# Altium schematic sheet Sheet2.SchDoc
size A4; SheetNumber: 3; SheetTotal: 3
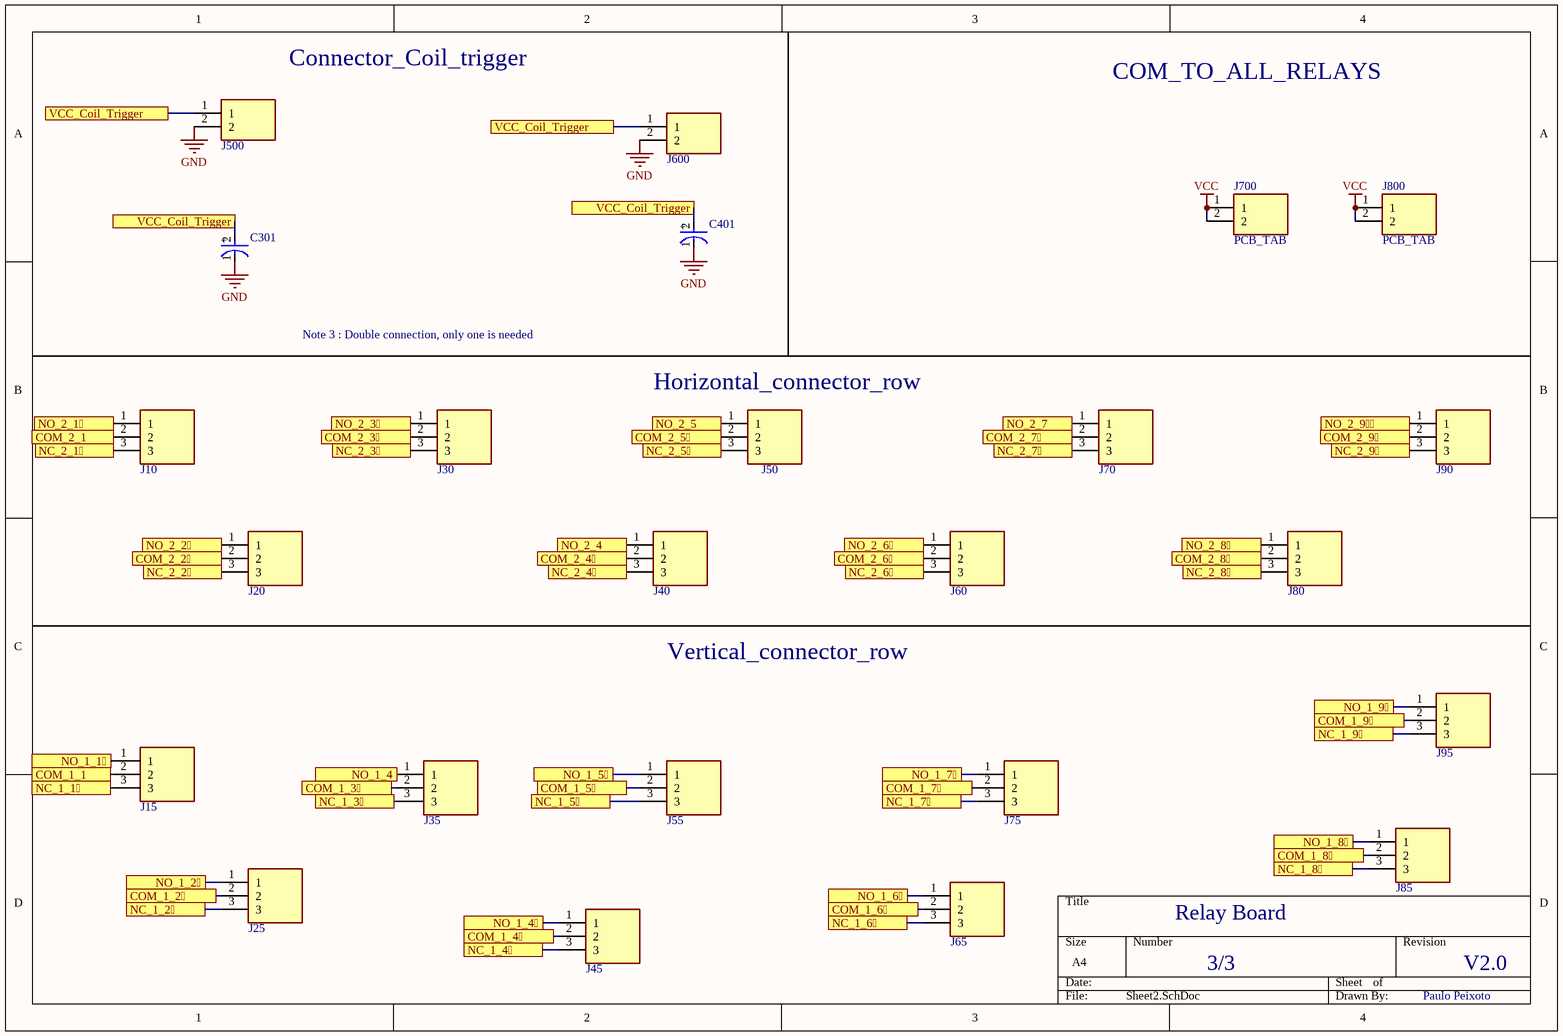
[diagram p0: Sheet2.SchDoc]

## Parts
C301  EEE-FK1H100UR  [FP-FKC-MFG]  (value not drawn)
C401  EEE-FK1H100UR  [FP-FKC-MFG]  (value not drawn)
J10  1546551-3  [Terminal_3p_3.5mm_Horizontal]  (value not drawn)
J15  1546551-3  [Terminal_THT_3p_3.5mm_Vertical]  (value not drawn)
J20  1546551-3  [Terminal_3p_3.5mm_Horizontal]  (value not drawn)
J25  1546551-3  [Terminal_THT_3p_3.5mm_Vertical]  (value not drawn)
J30  1546551-3  [Terminal_3p_3.5mm_Horizontal]  (value not drawn)
J35  1546551-3  [Terminal_THT_3p_3.5mm_Vertical]  (value not drawn)
J40  1546551-3  [Terminal_3p_3.5mm_Horizontal]  (value not drawn)
J45  1546551-3  [Terminal_THT_3p_3.5mm_Vertical]  (value not drawn)
J50  1546551-3  [Terminal_3p_3.5mm_Horizontal]  (value not drawn)
J55  1546551-3  [Terminal_THT_3p_3.5mm_Vertical]  (value not drawn)
J60  1546551-3  [Terminal_3p_3.5mm_Horizontal]  (value not drawn)
J65  1546551-3  [Terminal_THT_3p_3.5mm_Vertical]  (value not drawn)
J70  1546551-3  [Terminal_3p_3.5mm_Horizontal]  (value not drawn)
J75  1546551-3  [Terminal_THT_3p_3.5mm_Vertical]  (value not drawn)
J80  1546551-3  [Terminal_3p_3.5mm_Horizontal]  (value not drawn)
J85  1546551-3  [Terminal_THT_3p_3.5mm_Vertical]  (value not drawn)
J90  1546551-3  [Terminal_3p_3.5mm_Horizontal]  (value not drawn)
J95  1546551-3  [Terminal_THT_3p_3.5mm_Vertical]  (value not drawn)
J500  TB004-508-02BE  [Terminal_TH_2P_3.50]  (value not drawn)
J600  TB004-508-02BE  [Terminal_TH_2P_3.50]  (value not drawn)
J700  PCB_TAB  [PCB_TAB_Vertical_6.35mm]
J800  PCB_TAB  [PCB_TAB_Vertical_6.35mm]

## Ports
COM_1_1 (see Sheet1[2B]), COM_1_2 (see Sheet1[4B]), COM_1_3 (see Sheet1[6B]), COM_1_4 (see Sheet1[2C]), COM_1_5 (see Sheet1[4C]), COM_1_6 (see Sheet1[6C]), COM_1_7 (see Sheet1[2D]), COM_1_8 (see Sheet1[4D]), COM_1_9 (see Sheet1[6D]), COM_2_1 (see Sheet1[2A]), COM_2_2 (see Sheet1[4A]), COM_2_3 (see Sheet1[6A]), COM_2_4 (see Sheet1[2B]), COM_2_5 (see Sheet1[4B]), COM_2_6 (see Sheet1[6B]), COM_2_7 (see Sheet1[2C]), COM_2_8 (see Sheet1[4C]), COM_2_9 (see Sheet1[6C]), NC_1_1 (see Sheet1[2B]), NC_1_2 (see Sheet1[4B]), NC_1_3 (see Sheet1[6B]), NC_1_4 (see Sheet1[2C]), NC_1_5 (see Sheet1[4C]), NC_1_6 (see Sheet1[6C]), NC_1_7 (see Sheet1[2D]), NC_1_8 (see Sheet1[4D]), NC_1_9 (see Sheet1[6D]), NC_2_1 (see Sheet1[2A]), NC_2_2 (see Sheet1[4A]), NC_2_3 (see Sheet1[6A]), NC_2_4 (see Sheet1[2B]), NC_2_5 (see Sheet1[4B]), NC_2_6 (see Sheet1[6B]), NC_2_7 (see Sheet1[2C]), NC_2_8 (see Sheet1[4C]), NC_2_9 (see Sheet1[6C]), NO_1_1 (see Sheet1[2B]), NO_1_2 (see Sheet1[4B]), NO_1_4 (see Sheet1[2C]), NO_1_4 (see Sheet1[6B]), NO_1_5 (see Sheet1[4C]), NO_1_6 (see Sheet1[6C]), NO_1_7 (see Sheet1[2D]), NO_1_8 (see Sheet1[4D]), NO_1_9 (see Sheet1[6D]), NO_2_1 (see Sheet1[2A]), NO_2_2 (see Sheet1[4A]), NO_2_3 (see Sheet1[6A]), NO_2_4 (see Sheet1[2B]), NO_2_5 (see Sheet1[4B]), NO_2_6 (see Sheet1[6B]), NO_2_7 (see Sheet1[2C]), NO_2_8 (see Sheet1[4C]), NO_2_9 (see Sheet1[6C]), VCC_Coil_Trigger (see Sheet1[1A], Sheet1[1C], Sheet1[1D], Sheet1[3A], Sheet1[3C], Sheet1[3D], Sheet1[5A], Sheet1[5C], Sheet1[5D], Sheet2[1A], Sheet2[2A], Sheet4[2B], Sheet4[2C], Sheet4[2D], Sheet4[3B], Sheet4[3C], Sheet4[3D], Sheet4[4B], Sheet4[4C], Sheet4[4D])

## Nets
GND: C301.1(C) C401.1(C) J500.2 J600.2
VCC: J700.1 J700.2 J800.1 J800.2
COM_1_1: J15.2 ; port COM_1_1
COM_1_2: J25.2 ; port COM_1_2
COM_1_3: J35.2 ; port COM_1_3
COM_1_4: J45.2 ; port COM_1_4
COM_1_5: J55.2 ; port COM_1_5
COM_1_6: J65.2 ; port COM_1_6
COM_1_7: J75.2 ; port COM_1_7
COM_1_8: J85.2 ; port COM_1_8
COM_1_9: J95.2 ; port COM_1_9
COM_2_1: J10.2 ; port COM_2_1
COM_2_2: J20.2 ; port COM_2_2
COM_2_3: J30.2 ; port COM_2_3
COM_2_4: J40.2 ; port COM_2_4
COM_2_5: J50.2 ; port COM_2_5
COM_2_6: J60.2 ; port COM_2_6
COM_2_7: J70.2 ; port COM_2_7
COM_2_8: J80.2 ; port COM_2_8
COM_2_9: J90.2 ; port COM_2_9
NC_1_1: J15.3 ; port NC_1_1
NC_1_2: J25.3 ; port NC_1_2
NC_1_3: J35.3 ; port NC_1_3
NC_1_4: J45.3 ; port NC_1_4
NC_1_5: J55.3 ; port NC_1_5
NC_1_6: J65.3 ; port NC_1_6
NC_1_7: J75.3 ; port NC_1_7
NC_1_8: J85.3 ; port NC_1_8
NC_1_9: J95.3 ; port NC_1_9
NC_2_1: J10.3 ; port NC_2_1
NC_2_2: J20.3 ; port NC_2_2
NC_2_3: J30.3 ; port NC_2_3
NC_2_4: J40.3 ; port NC_2_4
NC_2_5: J50.3 ; port NC_2_5
NC_2_6: J60.3 ; port NC_2_6
NC_2_7: J70.3 ; port NC_2_7
NC_2_8: J80.3 ; port NC_2_8
NC_2_9: J90.3 ; port NC_2_9
NO_1_1: J15.1 ; port NO_1_1
NO_1_2: J25.1 ; port NO_1_2
NO_1_4: J35.1 ; port NO_1_4
NO_1_4: J45.1 ; port NO_1_4
NO_1_5: J55.1 ; port NO_1_5
NO_1_6: J65.1 ; port NO_1_6
NO_1_7: J75.1 ; port NO_1_7
NO_1_8: J85.1 ; port NO_1_8
NO_1_9: J95.1 ; port NO_1_9
NO_2_1: J10.1 ; port NO_2_1
NO_2_2: J20.1 ; port NO_2_2
NO_2_3: J30.1 ; port NO_2_3
NO_2_4: J40.1 ; port NO_2_4
NO_2_5: J50.1 ; port NO_2_5
NO_2_6: J60.1 ; port NO_2_6
NO_2_7: J70.1 ; port NO_2_7
NO_2_8: J80.1 ; port NO_2_8
NO_2_9: J90.1 ; port NO_2_9
VCC_Coil_Trigger: C301.2(A) C401.2(A) J500.1 J600.1 ; port VCC_Coil_Trigger

## Notes on the sheet
- Connector_Coil_trigger
- COM_TO_ALL_RELAYS
- Note 3 : Double connection, only one is needed
- (near J50) Horizontal_connector_row
- Vertical_connector_row
- Relay Board
- 3/3
- V2.0
- Paulo Peixoto
- (in symbol CMP-05427-000030-1) +

## Library data of the parts
C301 C401 = CMP-05427-000030-1: CAP ALUM 10UF 20% 50V SMD; Impedance: 1.52R; Ripple Current (AC): 85mA; Life (Hours): 2000Hour; Leakage Current: 3uA; Dielectric Material: Aluminium; Length: 5.8mm; Voltage Rating: 50V; Radiation Hardening: No; Max Operating Temperature: 105°C; REACH SVHC: No SVHC; Tolerance: 20%; RoHS Compliant: Yes; Case/Package: Radial; Height: 5.8mm; Voltage: 50V; Diameter: 5mm; Number of Pins: 2; Ripple Current: 85mA; Series: FK; Lead Free: Lead Free; Width: 6.5mm; ESR (Equivalent Series Resistance): 1.52R; Package Quantity: 1000; Construction: Cylindrical; Voltage Rating (DC): 50V; Packaging: Tape and Reel; Height - Seated (Max): 0.228inch; Contact Plating: Tin; Capacitance: 10uF; Min Operating Temperature: -55°C; Termination: SMD/SMT; Material: Aluminium; Mount: Surface Mount
J10 J15 J20 J25 J30 J35 J40 J45 J50 J55 J60 J65 J70 J75 J80 J85 J90 J95 = Con_Terminal_3P: Terminal; Manufacturer_Name: TE Connectivity; Datasheet Link: https://www.te.com/commerce/DocumentDelivery/DDEController?Action=srchrtrv&DocNm=1546551&DocType=Customer+Drawing&DocLang=English&DocFormat=pdf&PartCntxt=1546551-3; Height: 8.5mm; Manufacturer_Part_Number: 1546551-3; Arrow Part Number: 1546551-3; Arrow Price/Stock: https://www.arrow.com/en/products/1546551-3/te-connectivity; Mouser Part Number: 571-1546551-3; Mouser Price/Stock: https://www.mouser.co.uk/ProductDetail/TE-Connectivity/1546551-3?qs=m%2FhmcwQ75LlRawcWGeRFDA%3D%3D
J500 J600 = Con_Terminal_2P: Connector; Manufacturer_Name: CUI Devices; Datasheet Link: https://componentsearchengine.com/Datasheets/1/TB004-508-02BE.pdf; Height: 14.1mm; Manufacturer_Part_Number: TB004-508-02BE; Arrow Part Number: TB004-508-02BE; Arrow Price/Stock: https://www.arrow.com/en/products/tb004-508-02be/cui-inc; Mouser Part Number: 490-TB004-508-02BE; Mouser Price/Stock: https://www.mouser.co.uk/ProductDetail/CUI-Devices/TB004-508-02BE?qs=vLWxofP3U2zLwdGzG2tSkA%3D%3D